# EAGLE design iPod-Video-breakout (EAGLE 9.6.2)
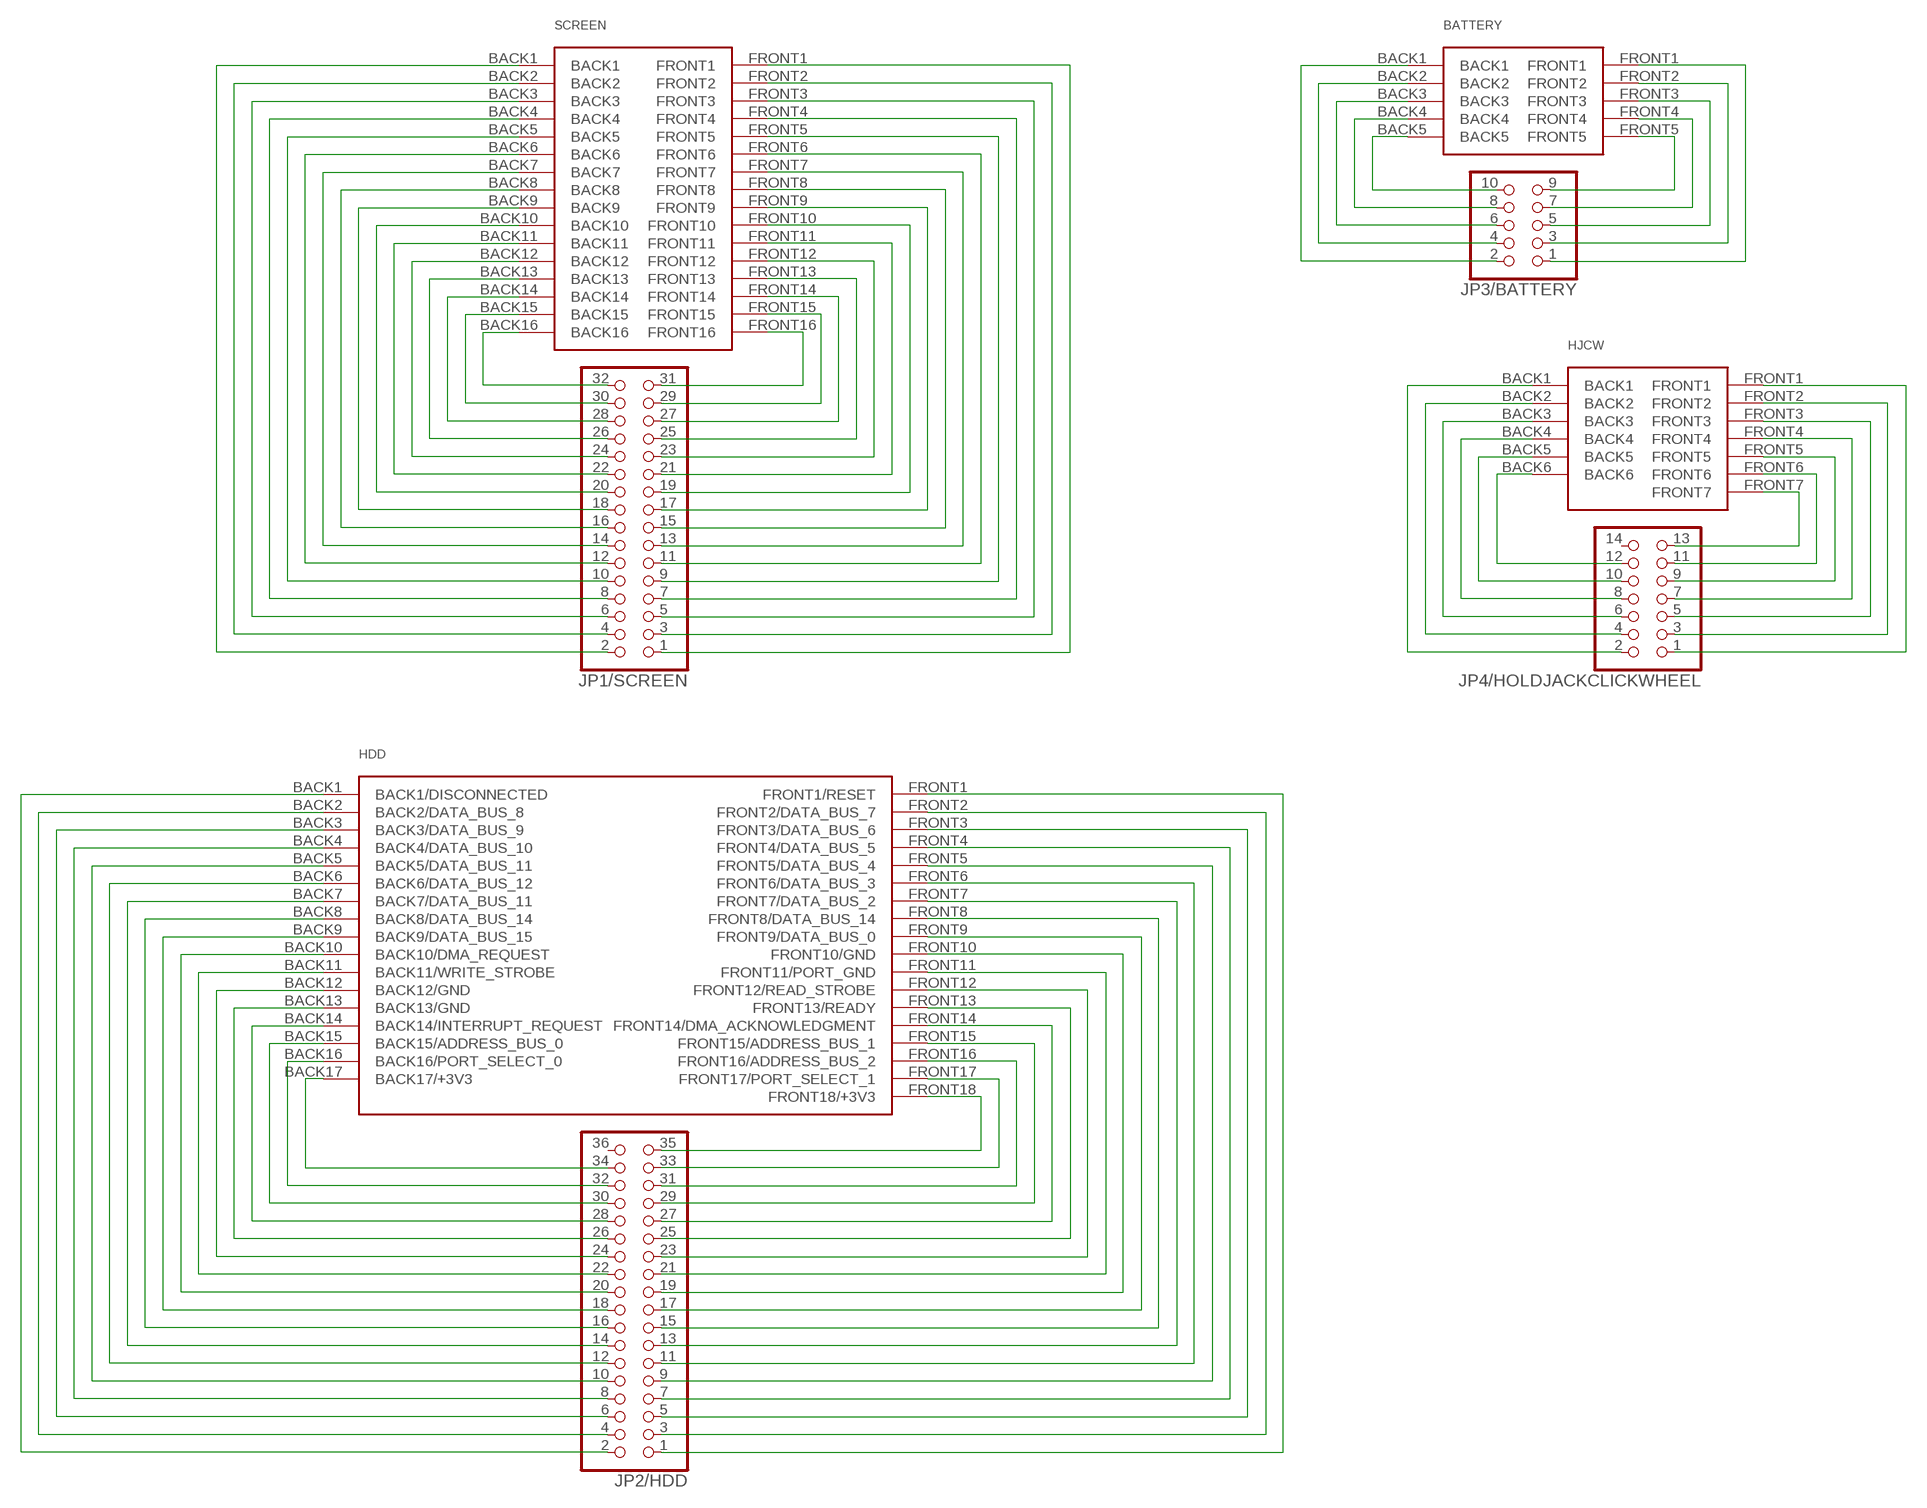
[diagram p0: schematic, sheet 1]

## Parts
BATTERY  526100572/BATTERY  [526100572]
HDD  5035663502/HDD  [5035663502]
HJCW  5035661302/HOLDJACK&CLICKWHEEL  [5035661302]
JP1/SCREEN  PINHD-2X16  [2X16]
JP2/HDD  PINHD-2X18  [2X18]
JP3/BATTERY  PINHD-2X5  [2X05]
JP4/HOLDJACKCLICKWHEEL  PINHD-2X7  [2X07]
SCREEN  FF12-32A-R11A/SCREEN  [FF12-32A-R11A]

## Nets
N$1: JP1/SCREEN.32 SCREEN.BACK16
N$2: JP1/SCREEN.30 SCREEN.BACK15
N$3: JP1/SCREEN.28 SCREEN.BACK14
N$4: JP1/SCREEN.26 SCREEN.BACK13
N$5: JP1/SCREEN.24 SCREEN.BACK12
N$6: JP1/SCREEN.22 SCREEN.BACK11
N$7: JP1/SCREEN.20 SCREEN.BACK10
N$8: JP1/SCREEN.18 SCREEN.BACK9
N$9: JP1/SCREEN.16 SCREEN.BACK8
N$10: JP1/SCREEN.14 SCREEN.BACK7
N$11: JP1/SCREEN.12 SCREEN.BACK6
N$12: JP1/SCREEN.10 SCREEN.BACK5
N$13: JP1/SCREEN.8 SCREEN.BACK4
N$14: JP1/SCREEN.6 SCREEN.BACK3
N$15: JP1/SCREEN.4 SCREEN.BACK2
N$16: JP1/SCREEN.2 SCREEN.BACK1
N$17: JP1/SCREEN.31 SCREEN.FRONT16
N$18: JP1/SCREEN.29 SCREEN.FRONT15
N$19: JP1/SCREEN.27 SCREEN.FRONT14
N$20: JP1/SCREEN.25 SCREEN.FRONT13
N$21: JP1/SCREEN.23 SCREEN.FRONT12
N$22: JP1/SCREEN.21 SCREEN.FRONT11
N$23: JP1/SCREEN.19 SCREEN.FRONT10
N$24: JP1/SCREEN.17 SCREEN.FRONT9
N$25: JP1/SCREEN.15 SCREEN.FRONT8
N$26: JP1/SCREEN.13 SCREEN.FRONT7
N$27: JP1/SCREEN.11 SCREEN.FRONT6
N$28: JP1/SCREEN.9 SCREEN.FRONT5
N$29: JP1/SCREEN.7 SCREEN.FRONT4
N$30: JP1/SCREEN.5 SCREEN.FRONT3
N$31: JP1/SCREEN.3 SCREEN.FRONT2
N$32: JP1/SCREEN.1 SCREEN.FRONT1
N$33: HDD.BACK17(BACK17/+3V3) JP2/HDD.34
N$34: HDD.BACK16(BACK16/PORT_SELECT_0) JP2/HDD.32
N$35: HDD.BACK15(BACK15/ADDRESS_BUS_0) JP2/HDD.30
N$36: HDD.BACK14(BACK14/INTERRUPT_REQUEST) JP2/HDD.28
N$37: HDD.BACK13(BACK13/GND) JP2/HDD.26
N$38: HDD.BACK12(BACK12/GND) JP2/HDD.24
N$39: HDD.BACK11(BACK11/WRITE_STROBE) JP2/HDD.22
N$40: HDD.BACK10(BACK10/DMA_REQUEST) JP2/HDD.20
N$41: HDD.BACK9(BACK9/DATA_BUS_15) JP2/HDD.18
N$42: HDD.BACK8(BACK8/DATA_BUS_14) JP2/HDD.16
N$43: HDD.BACK7(BACK7/DATA_BUS_11) JP2/HDD.14
N$44: HDD.BACK6(BACK6/DATA_BUS_12) JP2/HDD.12
N$45: HDD.BACK5(BACK5/DATA_BUS_11) JP2/HDD.10
N$46: HDD.BACK4(BACK4/DATA_BUS_10) JP2/HDD.8
N$47: HDD.BACK3(BACK3/DATA_BUS_9) JP2/HDD.6
N$48: HDD.BACK2(BACK2/DATA_BUS_8) JP2/HDD.4
N$49: HDD.BACK1(BACK1/DISCONNECTED) JP2/HDD.2
N$50: HDD.FRONT18(FRONT18/+3V3) JP2/HDD.35
N$51: HDD.FRONT17(FRONT17/PORT_SELECT_1) JP2/HDD.33
N$52: HDD.FRONT16(FRONT16/ADDRESS_BUS_2) JP2/HDD.31
N$53: HDD.FRONT15(FRONT15/ADDRESS_BUS_1) JP2/HDD.29
N$54: HDD.FRONT14(FRONT14/DMA_ACKNOWLEDGMENT) JP2/HDD.27
N$55: HDD.FRONT13(FRONT13/READY) JP2/HDD.25
N$56: HDD.FRONT12(FRONT12/READ_STROBE) JP2/HDD.23
N$57: HDD.FRONT11(FRONT11/PORT_GND) JP2/HDD.21
N$58: HDD.FRONT10(FRONT10/GND) JP2/HDD.19
N$59: HDD.FRONT9(FRONT9/DATA_BUS_0) JP2/HDD.17
N$60: HDD.FRONT8(FRONT8/DATA_BUS_14) JP2/HDD.15
N$61: HDD.FRONT7(FRONT7/DATA_BUS_2) JP2/HDD.13
N$62: HDD.FRONT6(FRONT6/DATA_BUS_3) JP2/HDD.11
N$63: HDD.FRONT5(FRONT5/DATA_BUS_4) JP2/HDD.9
N$64: HDD.FRONT4(FRONT4/DATA_BUS_5) JP2/HDD.7
N$65: HDD.FRONT3(FRONT3/DATA_BUS_6) JP2/HDD.5
N$66: HDD.FRONT2(FRONT2/DATA_BUS_7) JP2/HDD.3
N$67: HDD.FRONT1(FRONT1/RESET) JP2/HDD.1
N$68: BATTERY.BACK5 JP3/BATTERY.10
N$69: BATTERY.BACK4 JP3/BATTERY.8
N$70: BATTERY.BACK3 JP3/BATTERY.6
N$71: BATTERY.BACK2 JP3/BATTERY.4
N$72: BATTERY.BACK1 JP3/BATTERY.2
N$73: BATTERY.FRONT5 JP3/BATTERY.9
N$74: BATTERY.FRONT4 JP3/BATTERY.7
N$75: BATTERY.FRONT3 JP3/BATTERY.5
N$76: BATTERY.FRONT2 JP3/BATTERY.3
N$77: BATTERY.FRONT1 JP3/BATTERY.1
N$78: HJCW.BACK6 JP4/HOLDJACKCLICKWHEEL.12
N$79: HJCW.BACK5 JP4/HOLDJACKCLICKWHEEL.10
N$80: HJCW.BACK4 JP4/HOLDJACKCLICKWHEEL.8
N$81: HJCW.BACK3 JP4/HOLDJACKCLICKWHEEL.6
N$82: HJCW.BACK2 JP4/HOLDJACKCLICKWHEEL.4
N$83: HJCW.BACK1 JP4/HOLDJACKCLICKWHEEL.2
N$84: HJCW.FRONT7 JP4/HOLDJACKCLICKWHEEL.13
N$85: HJCW.FRONT6 JP4/HOLDJACKCLICKWHEEL.11
N$86: HJCW.FRONT5 JP4/HOLDJACKCLICKWHEEL.9
N$87: HJCW.FRONT4 JP4/HOLDJACKCLICKWHEEL.7
N$88: HJCW.FRONT3 JP4/HOLDJACKCLICKWHEEL.5
N$89: HJCW.FRONT2 JP4/HOLDJACKCLICKWHEEL.3
N$90: HJCW.FRONT1 JP4/HOLDJACKCLICKWHEEL.1
Unconnected: JP2/HDD.36 JP4/HOLDJACKCLICKWHEEL.14

## Library data of the parts
BATTERY = connectors:526100572/BATTERY
HDD = connectors:5035663502/HDD
HJCW = connectors:5035661302/HOLDJACK&CLICKWHEEL
JP1/SCREEN = pinhead:PINHD-2X16: PIN HEADER
JP2/HDD = pinhead:PINHD-2X18: PIN HEADER
JP3/BATTERY = pinhead:PINHD-2X5: PIN HEADER
JP4/HOLDJACKCLICKWHEEL = pinhead:PINHD-2X7: PIN HEADER
SCREEN = connectors:FF12-32A-R11A/SCREEN

## Board
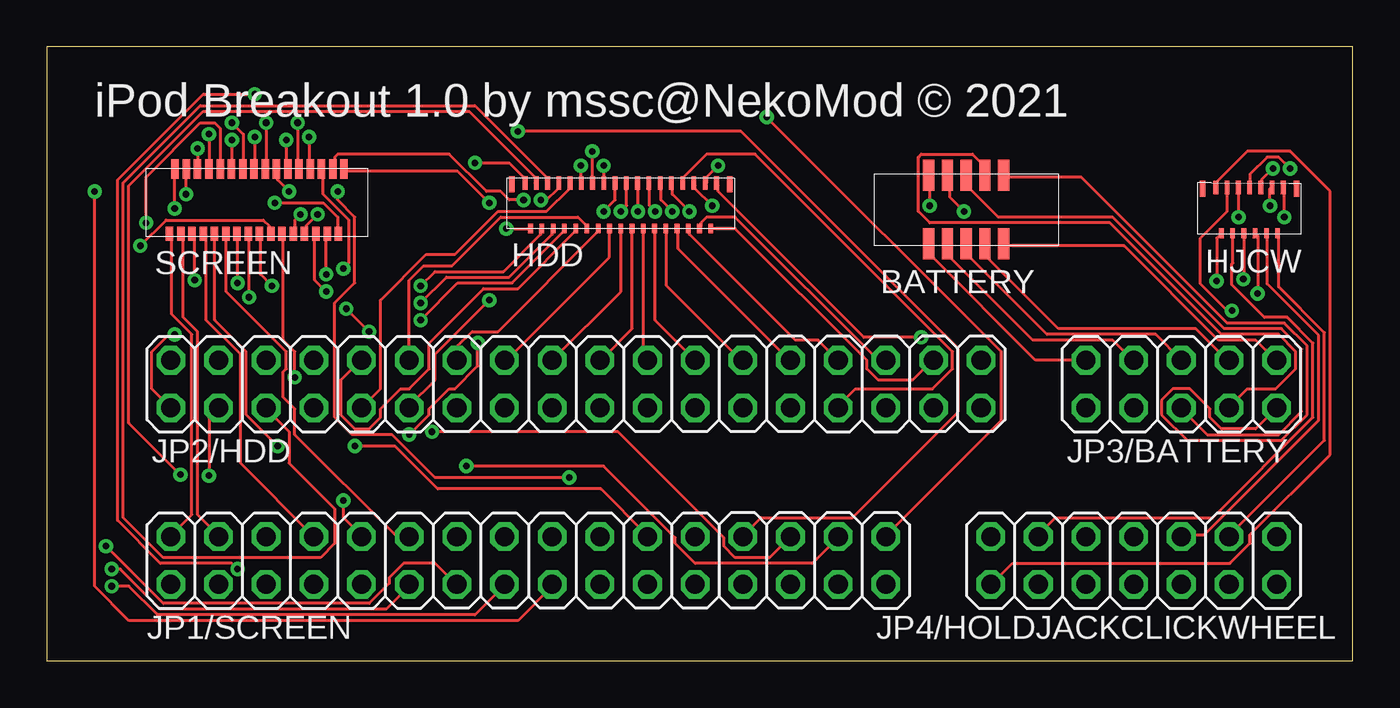
[diagram p1: board, top side]
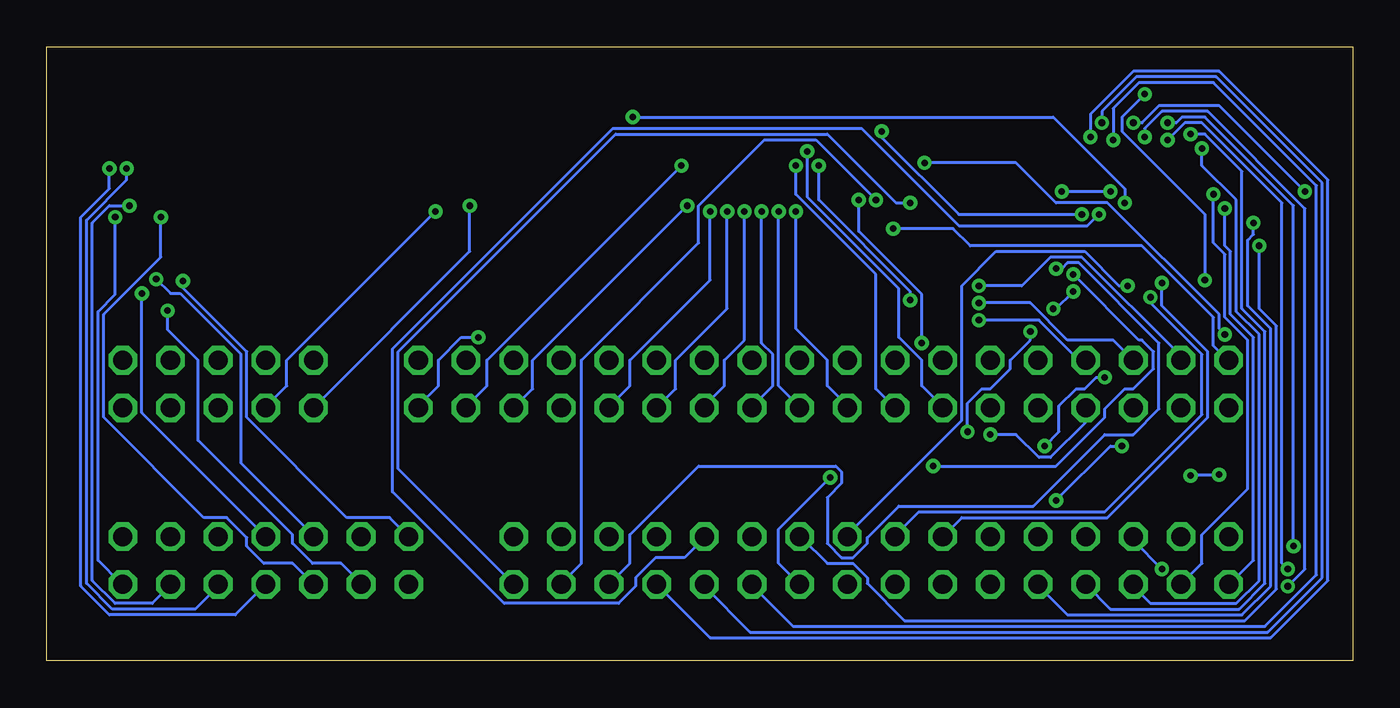
[diagram p2: board, bottom side, seen from below]

Size 69.58 x 32.69 mm. Coordinates in mm from the lower left corner, seen from the top.
Outline: 0,0 69.58,0 69.58,32.69 0,32.69 0,0
Copper layers (1*16): Top 0.035mm / dielectric 1.5mm / Bottom 0.035mm
Design rules "default": minimum track width 6mil, minimum drill 0.35mm, track to track 6mil, track to pad 6mil, pad to pad 6mil, via to via 6mil, smd to smd 6mil, copper to edge 40mil, drill to drill 6mil, minimum pad ring 10mil, minimum via ring 8mil, stop-mask expansion 4mil, vias tented up to drill 0mil, thermal gap 10mil

### Footprints (pad centres in the part's own frame; a part is rotated, then mirrored left to right if it is on the bottom)
526100572 = smd 1.65 x 0.6: BACK1 -2.44,2.02; BACK2 -2.44,1.02; BACK3 -2.44,0.02; BACK4 -2.44,-0.98; BACK5 -2.44,-1.98; FRONT1 1.22,2.02; FRONT2 1.22,1.02; FRONT3 1.22,0.02; FRONT4 1.22,-0.98; FRONT5 1.22,-1.98
5035663502 = smd 0.52 x 0.25: BACK1 -1.27,5.08; BACK2 -1.27,4.48; BACK3 -1.27,3.88; BACK4 -1.27,3.28; BACK5 -1.27,2.68; BACK6 -1.27,2.08; BACK7 -1.27,1.48; BACK8 -1.27,0.88; BACK9 -1.27,0.28; BACK10 -1.27,-0.32; BACK11 -1.27,-0.92; BACK12 -1.27,-1.52; BACK13 -1.27,-2.12; BACK14 -1.27,-2.72; BACK15 -1.27,-3.32; BACK16 -1.27,-3.92; BACK17 -1.27,-4.52 | smd 0.72 x 0.25: FRONT1 1.16,5.38; FRONT2 1.16,4.78; FRONT3 1.16,4.18; FRONT4 1.16,3.58; FRONT5 1.16,2.98; FRONT6 1.16,2.38; FRONT7 1.16,1.78; FRONT8 1.16,1.18; FRONT9 1.16,0.58; FRONT10 1.16,-0.02; FRONT11 1.16,-0.62; FRONT12 1.16,-1.22; FRONT13 1.16,-1.82; FRONT14 1.16,-2.42; FRONT15 1.16,-3.02; FRONT16 1.16,-3.62; FRONT17 1.16,-4.22; FRONT18 1.16,-4.82 | smd 0.85 x 0.3: SK1 1.09,6.09; SK2 1.09,-5.53
5035661302 = smd 0.52 x 0.25: BACK1 -0.43,1.7; BACK2 -0.43,1.1; BACK3 -0.43,0.5; BACK4 -0.43,-0.1; BACK5 -0.43,-0.7; BACK6 -0.43,-1.3 | smd 0.72 x 0.25: FRONT1 2,2; FRONT2 2,1.4; FRONT3 2,0.8; FRONT4 2,0.2; FRONT5 2,-0.4; FRONT6 2,-1; FRONT7 2,-1.6 | smd 0.85 x 0.3: SK1 1.94,2.71; SK2 1.94,-2.31
2X16 = drill 1.016 octagon: 1 -19.05,-1.27; 2 -19.05,1.27; 3 -16.51,-1.27; 4 -16.51,1.27; 5 -13.97,-1.27; 6 -13.97,1.27; 7 -11.43,-1.27; 8 -11.43,1.27; 9 -8.89,-1.27; 10 -8.89,1.27; 11 -6.35,-1.27; 12 -6.35,1.27; 13 -3.81,-1.27; 14 -3.81,1.27; 15 -1.27,-1.27; 16 -1.27,1.27; 17 1.27,-1.27; 18 1.27,1.27; 19 3.81,-1.27; 20 3.81,1.27; 21 6.35,-1.27; 22 6.35,1.27; 23 8.89,-1.27; 24 8.89,1.27; 25 11.43,-1.27; 26 11.43,1.27; 27 13.97,-1.27; 28 13.97,1.27; 29 16.51,-1.27; 30 16.51,1.27; 31 19.05,-1.27; 32 19.05,1.27
2X18 = drill 1.016 octagon: 1 -21.59,-1.27; 2 -21.59,1.27; 3 -19.05,-1.27; 4 -19.05,1.27; 5 -16.51,-1.27; 6 -16.51,1.27; 7 -13.97,-1.27; 8 -13.97,1.27; 9 -11.43,-1.27; 10 -11.43,1.27; 11 -8.89,-1.27; 12 -8.89,1.27; 13 -6.35,-1.27; 14 -6.35,1.27; 15 -3.81,-1.27; 16 -3.81,1.27; 17 -1.27,-1.27; 18 -1.27,1.27; 19 1.27,-1.27; 20 1.27,1.27; 21 3.81,-1.27; 22 3.81,1.27; 23 6.35,-1.27; 24 6.35,1.27; 25 8.89,-1.27; 26 8.89,1.27; 27 11.43,-1.27; 28 11.43,1.27; 29 13.97,-1.27; 30 13.97,1.27; 31 16.51,-1.27; 32 16.51,1.27; 33 19.05,-1.27; 34 19.05,1.27; 35 21.59,-1.27; 36 21.59,1.27
2X05 = drill 1.016 octagon: 1 -5.08,-1.27; 2 -5.08,1.27; 3 -2.54,-1.27; 4 -2.54,1.27; 5 0,-1.27; 6 0,1.27; 7 2.54,-1.27; 8 2.54,1.27; 9 5.08,-1.27; 10 5.08,1.27
2X07 = drill 1.016 octagon: 1 -7.62,-1.27; 2 -7.62,1.27; 3 -5.08,-1.27; 4 -5.08,1.27; 5 -2.54,-1.27; 6 -2.54,1.27; 7 0,-1.27; 8 0,1.27; 9 2.54,-1.27; 10 2.54,1.27; 11 5.08,-1.27; 12 5.08,1.27; 13 7.62,-1.27; 14 7.62,1.27
FF12-32A-R11A = smd 0.75 x 0.4: BACK1 -2.15,4.8; BACK2 -2.15,4.2; BACK3 -2.15,3.6; BACK4 -2.15,3; BACK5 -2.15,2.4; BACK6 -2.15,1.8; BACK7 -2.15,1.2; BACK8 -2.15,0.6; BACK9 -2.15,0; BACK10 -2.15,-0.6; BACK11 -2.15,-1.2; BACK12 -2.15,-1.8; BACK13 -2.15,-2.4; BACK14 -2.15,-3; BACK15 -2.15,-3.6; BACK16 -2.15,-4.2 | smd 1.05 x 0.4: FRONT1 1.3,4.5; FRONT2 1.3,3.9; FRONT3 1.3,3.3; FRONT4 1.3,2.7; FRONT5 1.3,2.1; FRONT6 1.3,1.5; FRONT7 1.3,0.9; FRONT8 1.3,0.3; FRONT9 1.3,-0.3; FRONT10 1.3,-0.9; FRONT11 1.3,-1.5; FRONT12 1.3,-2.1; FRONT13 1.3,-2.7; FRONT14 1.3,-3.3; FRONT15 1.3,-3.9; FRONT16 1.3,-4.5

### Placement (x,y rotation side)
BATTERY  49,24.64 90 top
HDD  30.86,24.29 90 top
HJCW  64.28,23.19 90 top
JP1/SCREEN  25.65,5.33 0 top
JP2/HDD  28.19,14.73 0 top
JP3/BATTERY  60.45,14.73 0 top
JP4/HOLDJACKCLICKWHEEL  57.91,5.33 0 top
SCREEN  11.33,24.89 90 top

### Tracks (layer width: path | path; a pad name or v marks a point on that pad's centre or on a via)
N$1  (via drill 0.35)
  Top 0.152: v12.14,24.38 14.73,24.38 15.49,23.62 15.49,22.86 SCREEN.BACK16 | v38.35,28.96 50.85,16.46 50.85,12.8 44.76,6.71 JP1/SCREEN.32
  Bottom 0.152: v12.14,24.38 12.14,25.15 15.95,28.96 v38.35,28.96
N$2  (via drill 0.35)
  Top 0.152: v14.88,20.57 14.88,22.71 SCREEN.BACK15 | v22.35,10.36 29.67,10.36 33.48,6.55 33.48,6.25 34.54,5.18 40.79,5.18 42.16,6.55 JP1/SCREEN.30
  Bottom 0.152: v14.88,20.57 11.38,17.07 11.23,17.07 10.62,16.46 10.62,15.54 11.68,14.48 12.14,14.48 13.21,13.41 13.21,12.95 15.8,10.36 v22.35,10.36
N$3  (via drill 0.35)
  Top 0.152: v14.88,19.66 14.28,20.27 14.28,22.71 SCREEN.BACK14 | v17.17,17.53 v15.95,18.75 | v20.52,12.19 30.43,12.19 36.07,6.55 36.07,6.1 36.68,5.49 38.51,5.49 JP1/SCREEN.28
  Bottom 0.152: v14.88,19.66 15.8,18.75 v15.95,18.75 | v17.17,17.53 17.17,17.07 18.24,16 18.24,15.54 19.3,14.48 19.76,14.48 20.52,13.72 v20.52,12.19
N$4  (via drill 0.35)
  Top 0.152: v14.43,23.77 13.82,23.16 13.82,22.86 SCREEN.BACK13 | v25.09,28.19 36.98,28.19 48.56,16.61 48.56,13.26 42.93,7.62 38.05,7.62 37.13,6.71 JP1/SCREEN.26
  Bottom 0.152: v14.43,23.77 20.98,23.77 25.09,27.89 v25.09,28.19
N$5  (via drill 0.35)
  Top 0.152: v13.51,23.77 13.21,23.47 13.21,22.86 SCREEN.BACK12
  Bottom 0.152: v13.51,23.77 14.12,23.16 20.98,23.16 26.16,28.35 39.42,28.35 51.16,16.61 51.16,8.99 45.21,3.05 39.12,3.05 38.2,3.96 38.2,4.42 37.13,5.49 35.61,5.49 34.54,6.55 JP1/SCREEN.24
N$6  (via drill 0.35)
  Top 0.152: v13.21,15.09 13.21,16.46 12.6,17.07 12.6,22.71 SCREEN.BACK11 | v16.41,11.43 18.54,11.43 20.83,9.14 29.52,9.14 31.95,6.71 JP1/SCREEN.22
  Bottom 0.152: v13.21,15.09 13.67,15.09 14.28,14.48 14.73,14.48 15.65,13.56 15.65,12.19 v16.41,11.43
N$7  (via drill 0.35)
  Top 0.152: v4.98,22.1 6.35,23.47 11.53,23.47 11.84,23.16 11.84,22.86 SCREEN.BACK10
  Bottom 0.152: v4.98,22.1 4.98,18.75 4.06,17.83 4.06,3.81 5.74,2.13 23.88,2.13 25.86,4.12 25.86,4.42 26.62,5.18 27.99,5.18 29.36,6.55 JP1/SCREEN.20
N$8  (via drill 0.35)
  Top 0.152: v11.99,19.96 11.38,20.57 11.38,22.71 SCREEN.BACK9
  Bottom 0.152: v11.99,19.96 12.45,19.96 14.28,21.79 19,21.79 20.83,19.96 20.83,12.8 26.92,6.71 JP1/SCREEN.18
N$9  (via drill 0.35)
  Top 0.152: v10.77,19.36 10.77,22.71 SCREEN.BACK8
  Bottom 0.152: v10.77,19.36 10.77,19.05 8.03,16.31 8.03,13.11 13.21,7.92 23.11,7.92 24.33,6.71 JP1/SCREEN.16
N$10  (via drill 0.35)
  Top 0.152: v10.16,20.12 10.16,22.71 SCREEN.BACK7
  Bottom 0.152: v10.16,20.12 10.16,18.9 7.72,16.46 7.72,12.95 13.06,7.62 20.83,7.62 JP1/SCREEN.14
N$11
  Top 0.152: SCREEN.BACK6 9.55,22.71 9.55,19.66 12.75,16.46 12.75,15.54 12.6,15.39 12.6,14.02 13.21,13.41 13.21,12.04 18.54,6.71 19.3,6.71 JP1/SCREEN.12
N$12  (via drill 0.35)
  Top 0.152: v12.29,11.43 10.62,13.11 10.62,16.46 8.94,18.14 8.94,22.71 SCREEN.BACK5 | v15.8,8.53 15.8,7.62 16.71,6.71 JP1/SCREEN.10
  Bottom 0.152: v12.29,11.43 12.9,11.43 v15.8,8.53
N$13
  Top 0.152: JP1/SCREEN.8 10.31,10.52 10.31,16.31 8.48,18.14 8.48,22.71 SCREEN.BACK4
N$14  (via drill 0.35)
  Top 0.152: v7.87,20.27 7.87,22.71 SCREEN.BACK3 | v11.07,30.18 8.33,30.18 3.76,25.6 3.76,7.47 6.04,5.18 9.86,5.18 v10.16,4.88
  Bottom 0.152: v7.87,20.27 7.87,23.77 12.29,28.19 12.29,28.96 v11.07,30.18 | v10.16,4.88 11.68,6.4 JP1/SCREEN.6
N$15
  Top 0.152: SCREEN.BACK2 7.26,22.71 7.26,18.29 8.03,17.53 8.03,7.77 9.09,6.71 JP1/SCREEN.4
N$16
  Top 0.152: SCREEN.BACK1 6.66,22.71 6.66,18.44 7.72,17.37 7.72,7.77 6.66,6.71 JP1/SCREEN.2
N$17  (via drill 0.35)
  Top 0.152: v23.57,24.38 21.89,26.06 15.95,26.06 SCREEN.FRONT16
  Bottom 0.152: v23.57,24.38 24.33,24.38 27.99,28.04 39.27,28.04 50.85,16.46 50.85,10.21 JP1/SCREEN.31
N$18  (via drill 0.35)
  Top 0.152: v25.4,24.54 24.64,24.54 24.18,24.99 23.42,24.99 21.44,26.97 15.49,26.97 15.34,26.82 15.34,26.21 SCREEN.FRONT15
  Bottom 0.152: v25.4,24.54 28.6,27.74 31.34,27.74 34.85,24.23 34.85,22.25 41.1,16 41.1,5.18 42.16,4.12 JP1/SCREEN.29
N$19  (via drill 0.35)
  Top 0.152: v15.8,20.88 16.1,21.18 16.1,23.47 14.73,24.84 14.73,26.06 SCREEN.FRONT14
  Bottom 0.152: v15.8,20.88 15.49,20.88 15.19,21.18 14.58,21.18 10.31,16.92 10.31,13.41 11.68,12.04 13.21,12.04 17.02,8.23 24.18,8.23 25.86,6.55 25.86,6.25 26.62,5.49 27.23,5.49 27.99,6.25 27.99,8.69 27.23,9.45 27.23,10.06 27.53,10.36 34.85,10.36 38.51,6.71 38.51,5.18 JP1/SCREEN.27
N$20  (via drill 0.35)
  Top 0.152: v13.97,27.89 13.97,26.21 SCREEN.FRONT13
  Bottom 0.152: v13.97,27.89 13.97,29.11 11.68,31.39 7.11,31.39 1.32,25.6 1.32,4.27 4.37,1.22 34.24,1.22 JP1/SCREEN.25
N$21  (via drill 0.35)
  Top 0.152: v13.36,28.65 13.36,26.21 SCREEN.FRONT12
  Bottom 0.152: v13.36,28.65 13.36,29.26 11.53,31.09 7.26,31.09 1.63,25.45 1.63,4.42 4.52,1.52 32.11,1.52 34.54,3.96 JP1/SCREEN.23
N$22  (via drill 0.35)
  Top 0.152: v12.75,27.74 12.75,26.21 SCREEN.FRONT11
  Bottom 0.152: v12.75,27.74 12.75,29.41 11.38,30.79 7.42,30.79 1.93,25.3 1.93,4.57 4.67,1.83 29.82,1.83 31.95,3.96 JP1/SCREEN.21
N$23  (via drill 0.35)
  Top 0.152: v12.9,24.99 12.29,25.6 12.29,26.06 SCREEN.FRONT10 | v15.49,24.99 15.49,24.54 16.41,23.62 16.41,20.12 15.34,19.05 15.34,12.95 16.26,12.04 18.39,12.04 20.68,9.75 v27.84,9.75
  Bottom 0.152: v15.49,24.99 v12.9,24.99 | v27.84,9.75 30.58,7.01 30.58,5.18 JP1/SCREEN.19
N$24  (via drill 0.35)
  Top 0.152: v11.68,28.65 11.68,26.21 SCREEN.FRONT9 | v2.54,24.99 2.54,3.96 4.37,2.13 25.09,2.13 26.92,3.96 JP1/SCREEN.17
  Bottom 0.152: v11.68,28.65 11.23,28.65 10.31,29.57 7.11,29.57 v2.54,24.99
N$25  (via drill 0.35)
  Top 0.152: v11.07,27.89 11.07,26.21 SCREEN.FRONT8 | v3.45,3.96 4.37,3.96 5.89,2.44 22.81,2.44 24.33,3.96 JP1/SCREEN.15
  Bottom 0.152: v11.07,27.89 11.07,28.35 10.16,29.26 7.72,29.26 2.54,24.08 2.54,4.88 v3.45,3.96
N$26  (via drill 0.35)
  Top 0.152: v9.86,28.65 10.46,28.04 10.46,26.21 SCREEN.FRONT7 | v3.15,6.1 6.2,3.05 17.17,3.05 18.24,4.12 18.24,4.42 19,5.18 20.68,5.18 21.74,4.12 JP1/SCREEN.13
  Bottom 0.152: v9.86,28.65 9.4,28.65 9.09,28.96 7.87,28.96 3.15,24.23 v3.15,6.1
N$27  (via drill 0.35)
  Top 0.152: v9.86,27.74 9.86,26.21 SCREEN.FRONT6 | v3.45,4.88 3.91,4.88 6.04,2.74 18.09,2.74 19.3,3.96 JP1/SCREEN.11
  Bottom 0.152: v9.86,27.74 8.94,28.65 8.03,28.65 3.76,24.38 3.76,5.18 v3.45,4.88
N$28  (via drill 0.35)
  Top 0.152: v5.28,23.32 5.28,25.76 8.18,28.65 8.94,28.65 9.25,28.35 9.25,26.21 SCREEN.FRONT5
  Bottom 0.152: v5.28,23.32 5.28,22.71 5.59,22.4 5.59,18.9 4.37,17.68 4.37,3.96 5.89,2.44 15.19,2.44 16.71,3.96 JP1/SCREEN.9
N$29  (via drill 0.35)
  Top 0.152: v8.64,28.04 8.64,26.21 SCREEN.FRONT4
  Bottom 0.152: v8.64,28.04 7.87,28.04 5.89,26.06 5.89,18.75 4.67,17.53 4.67,4.12 6.04,2.74 12.9,2.74 JP1/SCREEN.7
N$30  (via drill 0.35)
  Top 0.152: v8.03,27.28 8.03,26.21 SCREEN.FRONT3
  Bottom 0.152: v8.03,27.28 8.03,26.36 6.2,24.54 6.2,18.59 4.98,17.37 4.98,4.27 6.2,3.05 10.77,3.05 11.68,3.96 JP1/SCREEN.5
N$31  (via drill 0.35)
  Top 0.152: v7.42,24.84 7.42,26.06 SCREEN.FRONT2
  Bottom 0.152: v7.42,24.84 7.42,22.25 6.81,21.64 6.81,18.29 5.59,17.07 5.59,9.14 8.03,6.71 8.03,5.18 JP1/SCREEN.3
N$32  (via drill 0.35)
  Top 0.152: v6.81,24.08 6.81,26.06 SCREEN.FRONT1
  Bottom 0.152: v6.81,24.08 6.81,22.1 6.5,21.79 6.5,18.44 5.28,17.22 5.28,5.33 6.5,4.12 JP1/SCREEN.1
N$33
  Top 0.152: HDD.BACK17 35.46,23.01 36.68,23.01 43.69,16 43.69,15.54 44.3,14.93 46.13,14.93 47.19,16 JP2/HDD.34
N$34
  Top 0.152: JP2/HDD.32 44.3,16 36.68,23.62 35.15,23.62 34.85,23.32 34.85,23.16 HDD.BACK16
N$35
  Top 0.152: JP2/HDD.30 41.1,17.07 39.88,17.07 34.24,22.71 34.24,23.01 HDD.BACK15
N$36
  Top 0.152: HDD.BACK14 33.63,23.01 33.63,21.95 39.57,16 JP2/HDD.28
N$37
  Top 0.152: HDD.BACK13 33.02,23.01 33.02,19.96 36.98,16 JP2/HDD.26
N$38
  Top 0.152: JP2/HDD.24 32.41,18.14 32.41,23.01 HDD.BACK12
N$39
  Top 0.152: HDD.BACK11 31.8,23.01 31.8,16.15 31.95,16 JP2/HDD.22
N$40
  Top 0.152: HDD.BACK10 31.19,23.01 31.19,17.68 29.52,16 JP2/HDD.20
N$41
  Top 0.152: JP2/HDD.18 30.58,19.66 HDD.BACK9
N$42
  Top 0.152: HDD.BACK8 29.97,21.49 24.49,16 JP2/HDD.16
N$43
  Top 0.152: HDD.BACK7 29.36,23.01 29.36,22.86 24.03,17.53 22.66,17.53 21.89,16.76 21.89,16 JP2/HDD.14
N$44
  Top 0.152: JP2/HDD.12 19.3,20.27 20.07,21.03 21.59,21.03 24.18,23.62 28.3,23.62 28.75,23.16 HDD.BACK6
N$45
  Top 0.152: HDD.BACK5 28.14,23.01 28.14,22.86 25.09,19.81 23.27,19.81 20.37,16.92 20.37,15.54 19.3,14.48 18.85,14.48 17.78,13.41 17.78,12.95 17.17,12.34 16.41,12.34 15.65,13.11 15.65,14.93 16.71,16 JP2/HDD.10
N$46  (via drill 0.35)
  Top 0.152: v19.91,18.14 21.89,20.12 24.79,20.12 27.53,22.86 27.53,23.01 HDD.BACK4
  Bottom 0.152: v19.91,18.14 16.71,18.14 14.58,16 JP2/HDD.8
N$47  (via drill 0.35)
  Top 0.152: v19.91,19.05 21.29,20.42 24.64,20.42 26.92,22.71 26.92,23.01 HDD.BACK3
  Bottom 0.152: v19.91,19.05 17.17,19.05 15.19,17.07 12.75,17.07 JP2/HDD.6
N$48  (via drill 0.35)
  Top 0.152: v19.91,19.96 20.68,20.73 24.33,20.73 26.31,22.71 26.31,23.01 HDD.BACK2
  Bottom 0.152: v19.91,19.96 17.63,19.96 16.1,21.49 14.43,21.49 9.25,16.31 9.25,16 JP2/HDD.4
N$49  (via drill 0.35)
  Top 0.152: v24.49,23.01 25.7,23.01 HDD.BACK1
  Bottom 0.152: v24.49,23.01 21.29,23.01 20.37,22.1 11.23,22.1 7.42,18.29 7.42,16.76 6.66,16 JP2/HDD.2
N$50  (via drill 0.35)
  Top 0.152: v46.58,17.22 43.54,17.22 35.76,24.99 35.76,25.3 HDD.FRONT18
  Bottom 0.152: v46.58,17.22 47.5,17.22 48.72,16 48.72,14.63 49.78,13.56 JP2/HDD.35
N$51  (via drill 0.35)
  Top 0.152: v35.76,26.36 35.15,25.76 35.15,25.45 HDD.FRONT17
  Bottom 0.152: v35.76,26.36 46.13,16 46.13,14.63 47.19,13.56 JP2/HDD.33
N$52  (via drill 0.35)
  Top 0.152: v35.46,24.23 34.54,25.15 34.54,25.3 HDD.FRONT16
  Bottom 0.152: v35.46,24.23 43.69,16 43.69,14.48 JP2/HDD.31
N$53
  Top 0.152: HDD.FRONT15 33.93,25.45 33.93,25.76 35.15,26.97 37.74,26.97 48.26,16.46 48.26,15.54 47.19,14.48 43.08,14.48 42.16,13.56 JP2/HDD.29
N$54  (via drill 0.35)
  Top 0.152: v34.24,23.93 33.33,24.84 33.33,25.3 HDD.FRONT14
  Bottom 0.152: v34.24,23.93 34.24,20.27 38.51,16 38.51,14.63 39.57,13.56 JP2/HDD.27
N$55  (via drill 0.35)
  Top 0.152: v33.33,23.93 32.72,24.54 32.72,25.3 HDD.FRONT13
  Bottom 0.152: v33.33,23.93 33.33,18.75 36.07,16 36.07,14.48 JP2/HDD.25
N$56  (via drill 0.35)
  Top 0.152: v32.41,23.93 32.11,24.23 32.11,25.3 HDD.FRONT12
  Bottom 0.152: v32.41,23.93 32.41,17.07 33.48,16 33.48,14.63 34.54,13.56 JP2/HDD.23
N$57  (via drill 0.35)
  Top 0.152: v31.5,23.93 31.5,25.3 HDD.FRONT11
  Bottom 0.152: v31.5,23.93 31.5,16.92 30.89,16.31 30.89,14.63 31.95,13.56 JP2/HDD.21
N$58  (via drill 0.35)
  Top 0.152: v30.58,23.93 30.89,24.23 30.89,25.3 HDD.FRONT10
  Bottom 0.152: v30.58,23.93 30.58,14.63 29.52,13.56 JP2/HDD.19
N$59  (via drill 0.35)
  Top 0.152: v29.67,23.93 30.28,24.54 30.28,25.3 HDD.FRONT9
  Bottom 0.152: v29.67,23.93 29.67,17.68 27.99,16 27.99,14.63 26.92,13.56 JP2/HDD.17
N$60  (via drill 0.35)
  Top 0.152: v29.67,26.36 HDD.FRONT8
  Bottom 0.152: v29.67,26.36 29.67,24.84 25.4,20.57 25.4,14.48 JP2/HDD.15
N$61  (via drill 0.35)
  Top 0.152: v29.06,27.13 29.06,25.45 HDD.FRONT7
  Bottom 0.152: v29.06,27.13 29.06,24.69 24.18,19.81 24.18,17.22 22.96,16 22.96,14.63 21.89,13.56 JP2/HDD.13
N$62  (via drill 0.35)
  Top 0.152: v28.45,26.36 28.45,25.45 HDD.FRONT6 | v23.57,19.2 20.68,16.31 20.68,14.93 19.3,13.56 JP2/HDD.11
  Bottom 0.152: v28.45,26.36 28.45,24.54 23.57,19.66 v23.57,19.2
N$63
  Top 0.152: JP2/HDD.9 17.78,14.48 17.78,19.2 20.22,21.64 21.74,21.64 24.03,23.93 26.62,23.93 27.84,25.15 27.84,25.3 HDD.FRONT5
N$64  (via drill 0.35)
  Top 0.152: v26.31,24.54 26.62,24.54 27.23,25.15 27.23,25.3 HDD.FRONT4 | v22.96,16.92 22.96,15.7 21.74,14.48 21.44,14.48 20.37,13.41 20.37,13.11 v19.3,12.04
  Bottom 0.152: v26.31,24.54 26.31,22.86 22.96,19.51 v22.96,16.92 | v19.3,12.04 17.93,12.04 16.71,10.82 16.1,10.82 14.28,12.65 14.28,13.41 JP2/HDD.7
N$65
  Top 0.152: HDD.FRONT3 26.62,25.45 26.62,25.76 22.81,29.57 8.18,29.57 4.06,25.45 4.06,7.62 6.2,5.49 14.58,5.49 15.34,6.25 15.34,8.08 12.9,10.52 12.9,12.19 11.68,13.41 JP2/HDD.5
N$66  (via drill 0.35)
  Top 0.152: v7.11,9.91 4.37,12.65 4.37,25.3 8.33,29.26 22.5,29.26 26.01,25.76 26.01,25.45 HDD.FRONT2 | v8.64,9.86 8.64,12.95 JP2/HDD.3
  Bottom 0.152: v8.64,9.86 8.59,9.91 v7.11,9.91
N$67  (via drill 0.35)
  Top 0.152: v22.81,26.52 24.64,26.52 25.4,25.76 25.4,25.45 HDD.FRONT1 | v6.81,17.37 6.5,17.37 5.59,16.46 5.59,14.48 JP2/HDD.1
  Bottom 0.152: v22.81,26.52 17.93,26.52 15.8,24.38 13.06,24.38 7.11,18.44 7.11,17.68 v6.81,17.37
N$68
  Top 0.152: BATTERY.BACK5 51,22.1 57.4,22.1 62.43,17.07 64.41,17.07 65.48,16 JP3/BATTERY.10
N$69
  Top 0.152: BATTERY.BACK4 50.09,22.1 50.09,21.49 53.9,17.68 61.21,17.68 62.89,16 JP3/BATTERY.8
N$70
  Top 0.152: JP3/BATTERY.6 59.08,17.37 53.29,17.37 49.02,21.64 49.02,22.1 BATTERY.BACK3
N$71
  Top 0.152: BATTERY.BACK2 48.11,22.1 48.11,21.49 52.53,17.07 56.79,17.07 57.86,16 JP3/BATTERY.4
N$72
  Top 0.152: JP3/BATTERY.2 52.68,16 47.04,21.64 47.04,22.1 BATTERY.BACK1
N$73
  Top 0.152: JP3/BATTERY.9 64.41,12.34 62.59,12.34 61.98,12.95 61.98,13.41 60.91,14.48 59.99,14.48 59.38,13.87 59.38,13.11 60.76,11.73 65.79,11.73 67.16,13.11 67.16,16.76 65.94,17.98 62.89,17.98 55.12,25.76 51,25.76 BATTERY.FRONT5
N$74
  Top 0.152: BATTERY.FRONT4 49.94,25.91 49.94,26.36 49.33,26.97 46.58,26.97 46.43,26.82 46.43,23.93 47.04,23.32 56.64,23.32 62.59,17.37 65.63,17.37 66.55,16.46 66.55,15.54 65.48,14.48 63.96,14.48 63.04,13.56 JP3/BATTERY.7
N$75
  Top 0.152: BATTERY.FRONT3 49.02,25.76 49.02,25.3 50.7,23.62 56.79,23.62 62.74,17.68 65.79,17.68 66.85,16.61 66.85,13.26 65.63,12.04 61.82,12.04 60.45,13.41 JP3/BATTERY.5
N$76  (via drill 0.35)
  Top 0.152: v48.87,23.93 48.11,24.69 48.11,25.76 BATTERY.FRONT2
  Bottom 0.152: v48.87,23.93 56.79,16 56.79,14.63 57.86,13.56 JP3/BATTERY.3
N$77  (via drill 0.35)
  Top 0.152: v47.04,24.23 47.04,25.76 BATTERY.FRONT1
  Bottom 0.152: v47.04,24.23 47.04,21.79 JP3/BATTERY.1
N$78
  Top 0.152: HJCW.BACK6 65.63,22.71 65.63,19.91 68.07,17.47 68.07,11.73 63.04,6.71 JP4/HOLDJACKCLICKWHEEL.12
N$79
  Top 0.152: HJCW.BACK5 65.02,22.71 65.02,20.07 67.77,17.32 67.77,12.8 61.67,6.71 60.45,6.71 JP4/HOLDJACKCLICKWHEEL.10
N$80  (via drill 0.35)
  Top 0.152: HJCW.BACK4 64.52,22.63 v64.52,19.56
  Bottom 0.152: v64.52,19.56 64.52,13.21 JP4/HOLDJACKCLICKWHEEL.8
N$81  (via drill 0.35)
  Top 0.152: v63.75,20.32 63.8,20.37 63.8,22.71 HJCW.BACK3
  Bottom 0.152: v63.75,20.32 62.99,19.56 62.48,19.56 59.23,16.31 59.23,10.52 55.42,6.71 JP4/HOLDJACKCLICKWHEEL.6
N$82
  Top 0.152: HJCW.BACK2 63.2,22.71 63.2,21.18 63.14,21.13 63.14,20.02 64.87,18.29 66.09,18.29 67.46,16.92 67.46,12.95 62.13,7.62 53.75,7.62 52.83,6.71 JP4/HOLDJACKCLICKWHEEL.4
N$83  (via drill 0.35)
  Top 0.152: HJCW.BACK1 62.33,22.51 v62.33,20.22
  Bottom 0.152: v62.33,20.22 62.33,19.86 58.93,16.46 58.93,12.95 53.59,7.62 51.31,7.62 JP4/HOLDJACKCLICKWHEEL.2
N$84  (via drill 0.35)
  Top 0.152: v65.94,23.62 65.94,25.15 HJCW.FRONT7
  Bottom 0.152: v65.94,23.62 65.94,19.51 66.85,18.59 66.85,5.33 65.63,4.12 JP4/HOLDJACKCLICKWHEEL.13
N$85  (via drill 0.35)
  Top 0.152: v65.18,24.23 65.18,25.15 HJCW.FRONT6
  Bottom 0.152: v65.18,24.23 66.24,24.23 67.16,23.32 67.16,4.27 65.94,3.05 63.96,3.05 63.04,3.96 JP4/HOLDJACKCLICKWHEEL.11
N$86  (via drill 0.35)
  Top 0.152: v65.33,26.21 64.72,25.6 64.72,25.3 HJCW.FRONT5
  Bottom 0.152: v65.33,26.21 65.33,25.6 67.46,23.47 67.46,4.12 66.09,2.74 61.67,2.74 60.45,3.96 JP4/HOLDJACKCLICKWHEEL.9
N$87  (via drill 0.35)
  Top 0.152: v66.24,26.21 65.63,26.82 65.02,26.82 64.11,25.91 64.11,25.3 HJCW.FRONT4
  Bottom 0.152: v66.24,26.21 66.24,25.15 67.77,23.62 67.77,3.96 66.24,2.44 59.54,2.44 JP4/HOLDJACKCLICKWHEEL.7
N$88  (via drill 0.35)
  Top 0.152: v63.5,23.62 63.5,25.15 HJCW.FRONT3
  Bottom 0.152: v63.5,23.62 63.5,21.49 66.55,18.44 66.55,12.95 61.21,7.62 59.99,7.62 58.93,6.55 58.93,6.1 58.01,5.18 56.49,5.18 JP4/HOLDJACKCLICKWHEEL.5
N$89  (via drill 0.35)
  Top 0.152: v63.14,18.64 62.89,18.64 61.47,20.07 61.47,22.5 62.89,23.93 62.89,25.15 HJCW.FRONT2
  Bottom 0.152: v63.14,18.64 63.14,17.63 61.52,16 61.52,11.73 56.49,6.71 56.49,6.25 55.42,5.18 53.9,5.18 52.83,4.12 JP4/HOLDJACKCLICKWHEEL.3
N$90
  Top 0.152: HJCW.FRONT1 62.28,25.3 62.28,25.45 63.96,27.13 66.24,27.13 68.38,24.99 68.38,10.97 64.11,6.71 64.11,6.25 63.04,5.18 51.46,5.18 50.39,4.12 JP4/HOLDJACKCLICKWHEEL.1

### Text on the board
tNames: iPod Breakout 1.0 by mssc@NekoMod © 2021